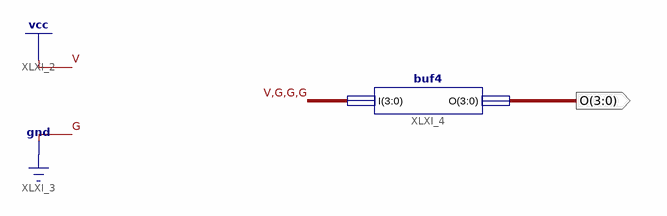
[diagram p0: schematic sheet 1]
// Xilinx ISE schematic constant4b1000.sch (spartan3adsp) as structural Verilog: 1 symbols, 1 ports
module constant4b1000 (
  output [3:0] O
);

  buf4 XLXI_4 (.I(4'b1000), .O(O));
endmodule
